# Altium schematic sheet CapacitorBank.SchDoc
size A; DocumentName: Reconfigurable Capacitor Bank
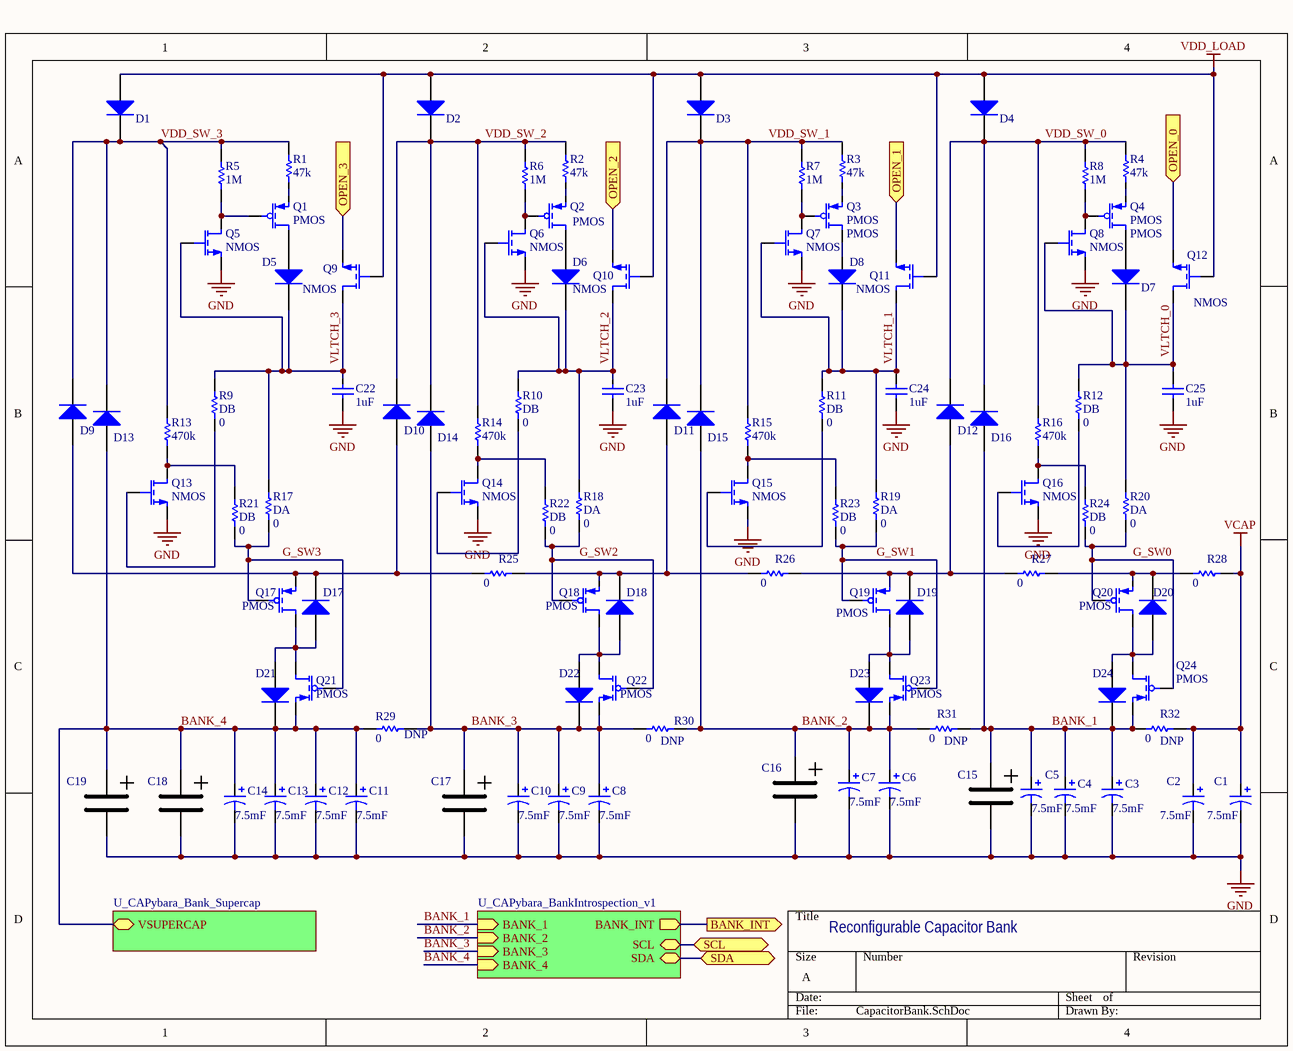
[diagram p0: CapacitorBank.SchDoc]

## Parts
C1  value 7.5mF  [CAP_CPH3225A]  (hidden comment: Cap - Polarized)
C2  value 7.5mF  [CAP_CPH3225A]  (hidden comment: Cap - Polarized)
C3  value 7.5mF  [CAP_CPH3225A]  (hidden comment: Cap - Polarized)
C4  value 7.5mF  [CAP_CPH3225A]  (hidden comment: Cap - Polarized)
C5  value 7.5mF  [CAP_CPH3225A]  (hidden comment: Cap - Polarized)
C6  value 7.5mF  [CAP_CPH3225A]  (hidden comment: Cap - Polarized)
C7  value 7.5mF  [CAP_CPH3225A]  (hidden comment: Cap - Polarized)
C8  value 7.5mF  [CAP_CPH3225A]  (hidden comment: Cap - Polarized)
C9  value 7.5mF  [CAP_CPH3225A]  (hidden comment: Cap - Polarized)
C10  value 7.5mF  [CAP_CPH3225A]  (hidden comment: Cap - Polarized)
C11  value 7.5mF  [CAP_CPH3225A]  (hidden comment: Cap - Polarized)
C12  value 7.5mF  [CAP_CPH3225A]  (hidden comment: Cap - Polarized)
C13  value 7.5mF  [CAP_CPH3225A]  (hidden comment: Cap - Polarized)
C14  value 7.5mF  [CAP_CPH3225A]  (hidden comment: Cap - Polarized)
C15  304DCN2R7SCBB  [CAP_ILLINOIS_DCN]  (value not drawn)
C16  304DCN2R7SCBB  [CAP_ILLINOIS_DCN]  (value not drawn)
C17  304DCN2R7SCBB  [CAP_ILLINOIS_DCN]  (value not drawn)
C18  304DCN2R7SCBB  [CAP_ILLINOIS_DCN]  (value not drawn)
C19  304DCN2R7SCBB  [CAP_ILLINOIS_DCN]  (value not drawn)
C22  value 1uF  [0603]  (hidden comment: Cap)
C23  value 1uF  [0603]  (hidden comment: Cap)
C24  value 1uF  [0603]  (hidden comment: Cap)
C25  value 1uF  [0603]  (hidden comment: Cap)
D1  Diode  [SOD-523]  (value not drawn)
D2  Diode  [SOD-523]  (value not drawn)
D3  Diode  [SOD-523]  (value not drawn)
D4  Diode  [SOD-523]  (value not drawn)
D5  Diode  [SOD-523]  (value not drawn)
D6  Diode  [SOD-523]  (value not drawn)
D7  Diode  [SOD-523]  (value not drawn)
D8  Diode  [SOD-523]  (value not drawn)
D9  Diode  [SOD-523]  (value not drawn)
D10  Diode  [SOD-523]  (value not drawn)
D11  Diode  [SOD-523]  (value not drawn)
D12  Diode  [SOD-523]  (value not drawn)
D13  Diode  [SOD-523]  (value not drawn)
D14  Diode  [SOD-523]  (value not drawn)
D15  Diode  [SOD-523]  (value not drawn)
D16  Diode  [SOD-523]  (value not drawn)
D17  Diode  [SOD-523]  (value not drawn)
D18  Diode  [SOD-523]  (value not drawn)
D19  Diode  [SOD-523]  (value not drawn)
D20  Diode  [SOD-523]  (value not drawn)
D21  Diode  [SOD-523]  (value not drawn)
D22  Diode  [SOD-523]  (value not drawn)
D23  Diode  [SOD-523]  (value not drawn)
D24  Diode  [SOD-523]  (value not drawn)
Q1  value PMOS  [SOT23 - N]
Q2  value PMOS  [SOT23 - N]
Q3  PMOS  [SOT23 - N]
Q4  PMOS  [SOT23 - N]
Q5  NMOS  [SOT23 - N]
Q6  NMOS  [SOT23 - N]
Q7  NMOS  [SOT23 - N]
Q8  NMOS  [SOT23 - N]
Q9  NMOS  [SOT23 - N]
Q10  NMOS  [SOT23 - N]
Q11  NMOS  [SOT23 - N]
Q12  NMOS  [SOT23 - N]
Q13  NMOS  [SOT23 - N]
Q14  NMOS  [SOT23 - N]
Q15  NMOS  [SOT23 - N]
Q16  NMOS  [SOT23 - N]
Q17  PMOS  [SOT23 - N]
Q18  PMOS  [SOT23 - N]
Q19  value PMOS  [SOT23 - N]
Q20  value PMOS  [SOT23 - N]
Q21  PMOS  [SOT23 - N]
Q22  PMOS  [SOT23 - N]
Q23  value PMOS  [SOT23 - N]
Q24  value PMOS  [SOT23 - N]
R1  value 47k  [0603]  (hidden comment: Res)
R2  value 47k  [0603]  (hidden comment: Res)
R3  value 47k  [0603]  (hidden comment: Res)
R4  value 47k  [0603]  (hidden comment: Res)
R5  value 1M  [0603]  (hidden comment: Res)
R6  value 1M  [0603]  (hidden comment: Res)
R7  value 1M  [0603]  (hidden comment: Res)
R8  value 1M  [0603]  (hidden comment: Res)
R9  DB  value 0  [0603]
R10  DB  value 0  [0603]
R11  DB  value 0  [0603]
R12  DB  value 0  [0603]
R13  value 470k  [0603]
R14  value 470k  [0603]
R15  value 470k  [0603]
R16  value 470k  [0603]
R17  DA  value 0  [0603]
R18  DA  value 0  [0603]
R19  DA  value 0  [0603]
R20  DA  value 0  [0603]
R21  DB  value 0  [0603]
R22  DB  value 0  [0603]
R23  DB  value 0  [0603]
R24  DB  value 0  [0603]
R25  value 0  [0603]  (hidden comment: Res)
R26  value 0  [0603]  (hidden comment: Res)
R27  value 0  [0603]  (hidden comment: Res)
R28  value 0  [0603]  (hidden comment: Res)
R29  value 0  Note: DNP  [0603]  (hidden comment: Res)
R30  value 0  Note: DNP  [0603]  (hidden comment: Res)
R31  value 0  Note: DNP  [0603]  (hidden comment: Res)
R32  value 0  Note: DNP  [0603]  (hidden comment: Res)

## Sub-sheets
U_CAPybara_Bank_Supercap = CAPybara_Bank_Supercap.SchDoc: VSUPERCAP (bidir)
U_CAPybara_BankIntrospection_v1 = CAPybara_Bank_Introspection_v1.SchDoc: BANK_INT (out), SCL (bidir), SDA (bidir), BANK_1 (in), BANK_2 (in), BANK_4 (in), BANK_3 (in)

## Ports
BANK_INT (out), OPEN_0 (in), OPEN_1 (in), OPEN_2 (in), OPEN_3 (in), SCL (bidir), SDA (bidir)

## Nets
GND: C1.2 C2.2 C3.2 C4.2 C5.2 C6.2 C7.2 C8.2 C9.2 C10.2 C11.2 C12.2 C13.2 C14.2 C15.2(N) C16.2(N) C17.2(N) C18.2(N) C19.2(N) C22.1 C23.1 C24.1 C25.1 Q5.2(S) Q6.2(S) Q7.2(S) Q8.2(S) Q13.2(S) Q14.2(S) Q15.2(S) Q16.2(S)
VCAP: C1.1 C2.1 R28.2 R32.2
VDD_LOAD: D1.1(A) D2.1(A) D3.1(A) D4.1(A) Q9.1(G) Q10.1(G) Q11.1(G) Q12.1(G)
BANK_1: C3.1 C4.1 C5.1 C15.1(P) D16.1(A) D24.2(C) Q24.2(S) R31.2 R32.1 ; sheet U_CAPybara_BankIntrospection_v1/BANK_1
BANK_2: C6.1 C7.1 C16.1(P) D15.1(A) D23.2(C) Q23.2(S) R30.2 R31.1 ; sheet U_CAPybara_BankIntrospection_v1/BANK_2
BANK_3: C8.1 C9.1 C10.1 C17.1(P) D14.1(A) D22.2(C) Q22.2(S) R29.2 R30.1 ; sheet U_CAPybara_BankIntrospection_v1/BANK_3
BANK_4: C11.1 C12.1 C13.1 C14.1 C18.1(P) C19.1(P) D13.1(A) D21.2(C) Q21.2(S) R29.1 ; sheet U_CAPybara_BankIntrospection_v1/BANK_4, sheet U_CAPybara_Bank_Supercap/VSUPERCAP
BANK_INT: port BANK_INT, sheet U_CAPybara_BankIntrospection_v1/BANK_INT
G_SW0: Q20.1(G) Q24.1(G) R20.1 R24.1
G_SW1: Q19.1(G) Q23.1(G) R19.1 R23.1
G_SW2: Q18.1(G) Q22.1(G) R18.1 R22.1
G_SW3: Q17.1(G) Q21.1(G) R17.1 R21.1
OPEN_0: Q12.2(S) ; port OPEN_0
OPEN_1: Q11.2(S) ; port OPEN_1
OPEN_2: Q10.2(S) ; port OPEN_2
OPEN_3: Q9.2(S) ; port OPEN_3
SCL: port SCL, sheet U_CAPybara_BankIntrospection_v1/SCL
SDA: port SDA, sheet U_CAPybara_BankIntrospection_v1/SDA
VDD_SW_0: D4.2(C) D12.2(C) D16.2(C) R4.2 R8.2 R16.2
VDD_SW_1: D3.2(C) D11.2(C) D15.2(C) R3.2 R7.2 R15.2
VDD_SW_2: D2.2(C) D10.2(C) D14.2(C) R2.2 R6.2 R14.2
VDD_SW_3: D1.2(C) D9.2(C) D13.2(C) R1.2 R5.2 R13.2
VLTCH_0: C25.2 D7.2(C) Q8.1(G) Q12.3(D) R12.2 R20.2
VLTCH_1: C24.2 D8.2(C) Q7.1(G) Q11.3(D) R11.2 R19.2
VLTCH_2: C23.2 D6.2(C) Q6.1(G) Q10.3(D) R10.2 R18.2
VLTCH_3: C22.2 D5.2(C) Q5.1(G) Q9.3(D) R9.2 R17.2
NetD5_1: D5.1(A) Q1.3(D)
NetD6_1: D6.1(A) Q2.3(D)
NetD7_1: D7.1(A) Q4.3(D)
NetD8_1: D8.1(A) Q3.3(D)
NetD9_1: D9.1(A) D10.1(A) D17.2(C) Q17.2(S) R25.1
NetD11_1: D11.1(A) D18.2(C) Q18.2(S) R25.2 R26.1
NetD12_1: D12.1(A) D19.2(C) Q19.2(S) R26.2 R27.1
NetD17_1: D17.1(A) D21.1(A) Q17.3(D) Q21.3(D)
NetD18_1: D18.1(A) D22.1(A) Q18.3(D) Q22.3(D)
NetD19_1: D19.1(A) D23.1(A) Q19.3(D) Q23.3(D)
NetD20_1: D20.1(A) D24.1(A) Q20.3(D) Q24.3(D)
NetD20_2: D20.2(C) Q20.2(S) R27.2 R28.1
NetQ1_1: Q1.1(G) Q5.3(D) R5.1
NetQ1_2: Q1.2(S) R1.1
NetQ2_1: Q2.1(G) Q6.3(D) R6.1
NetQ2_2: Q2.2(S) R2.1
NetQ3_1: Q3.1(G) Q7.3(D) R7.1
NetQ3_2: Q3.2(S) R3.1
NetQ4_1: Q4.1(G) Q8.3(D) R8.1
NetQ4_2: Q4.2(S) R4.1
NetQ13_1: Q13.1(G) R9.1
NetQ13_3: Q13.3(D) R13.1 R21.2
NetQ14_1: Q14.1(G) R10.1
NetQ14_3: Q14.3(D) R14.1 R22.2
NetQ15_1: Q15.1(G) R11.1
NetQ15_3: Q15.3(D) R15.1 R23.2
NetQ16_1: Q16.1(G) R12.1
NetQ16_3: Q16.3(D) R16.1 R24.2

## Notes on the sheet
- Reconfigurable Capacitor Bank

## Library data of the parts
C1-C14 = Cap - Polarized: Polarized Capacitor; Manufacturer Part Number: CPX3225A752D; Manufacturer: Seiko Instruments; Rating: 2.6V; Note: OPT; Digi-Key Part Number: 728-1083-1-ND; Distributor: Mouser; Distributor Part Number: 628-CPX3225A752D; Mouser Part Number: 628-CPX3225A752D
C15-C19 = SUPERCAP: EDLC Supercap; Manufacturer: Illinois Capacitor / CDE; Note: OPT; Rating: 2.7V; Value: 300mF; Distributor: Mouser; Distributor Part Number: 598-304DCN2R7SCBB; Manufacturer Part Number: 304DCN2R7SCBB; Digi-Key Part Number: 1572-1250-ND; Mouser Part Number: 598-304DCN2R7SCBB
C22-C25 = Cap: Ceramic Capacitor (Surface Mount); Manufacturer: Murata Electronics North America; Manufacturer Part Number: GRM188R61A105KA61D; Digi-Key Part Number: *; Note: *; Rating: *; Distributor Part Number: 490-1543-1-ND; Distributor: Digi-Key
D1-D24 = Diode: General Purpose Diode; Manufacturer: Vishay Semiconductor; Manufacturer Part Number: BAS40-02V-V-G-08; Digi-Key Part Number: BAS40-02V-V-G-08GICT-ND; Value: *; Rating: *; Note: *; Distributor Part Number: 78-BAS40-02V-V-G-08; Distributor: Mouser; Mouser Part Number: 78-BAS40-02V-V-G-08
Q1-Q4 Q17-Q24 = MOSFET-P: P-Channel MOSFET; Manufacturer Part Number: PMV30XPEAR; Manufacturer: Nexperia; Digi-Key Part Number: 1727-2531-1-ND; Note: *; Rating: *; Distributor: Mouser; Distributor Part Number: 771-PMV30XPEAR; Mouser Part Number: 771-PMV30XPEAR
  Q3 Q4 Q17 Q18 Q21 Q22: Value: PMOS
Q5-Q8 Q13-Q16 = MOSFET-N: N-Channel MOSFET; Manufacturer Part Number: SI2302CDS-T1-E3; Manufacturer: Vishay Siliconix; Digi-Key Part Number: SI2302CDS-T1-E3CT-ND; Note: *; Rating: *; Value: NMOS; Distributor: Mouser; Distributor Part Number: 781-SI2302CDS-E3; Mouser Part Number: 781-SI2302CDS-E3
Q9-Q12 = MOSFET-N: N-Channel MOSFET; Manufacturer Part Number: DMN65D8L-7; Manufacturer: Diodes Incorporated; Digi-Key Part Number: DMN65D8L-7DICT-ND; Note: *; Rating: *; Value: NMOS; Distributor: Mouser; Distributor Part Number: 621-DMN65D8L-7; Mouser Part Number: 621-DMN65D8L-7
R1-R4 = Res: Chip Resistor (Surface Mount); Manufacturer: Yageo; Manufacturer Part Number: RT0603DRD0747KL; Digi-Key Part Number: *; Rating: *; Note: *; Distributor: Digi-Key; Distributor Part Number: 311-47KDCT-ND
R5-R8 = Res: Chip Resistor (Surface Mount); Manufacturer: Yageo; Manufacturer Part Number: RC0603FR-071ML; Digi-Key Part Number: *; Rating: *; Note: *; Distributor: Digi-Key; Distributor Part Number: 311-1.00MHRCT-ND
R9-R12 R17-R32 = Res: Chip Resistor (Surface Mount); Manufacturer: Yageo; Manufacturer Part Number: RC0603JR-070RL; Rating: *; Distributor: Digi-Key; Distributor Part Number: 311-0.0GRCT-ND
  R9-R12 R17-R24: Note: *
R13-R16 = Res: Chip Resistor (Surface Mount); Manufacturer: Yageo; Manufacturer Part Number: RC0603FR-07470KL; Digi-Key Part Number: *; Rating: *; Note: *; Distributor: Digi-Key; Distributor Part Number: 311-470KHRCT-ND